# EAGLE design joystickschematic (EAGLE 9.6.2)
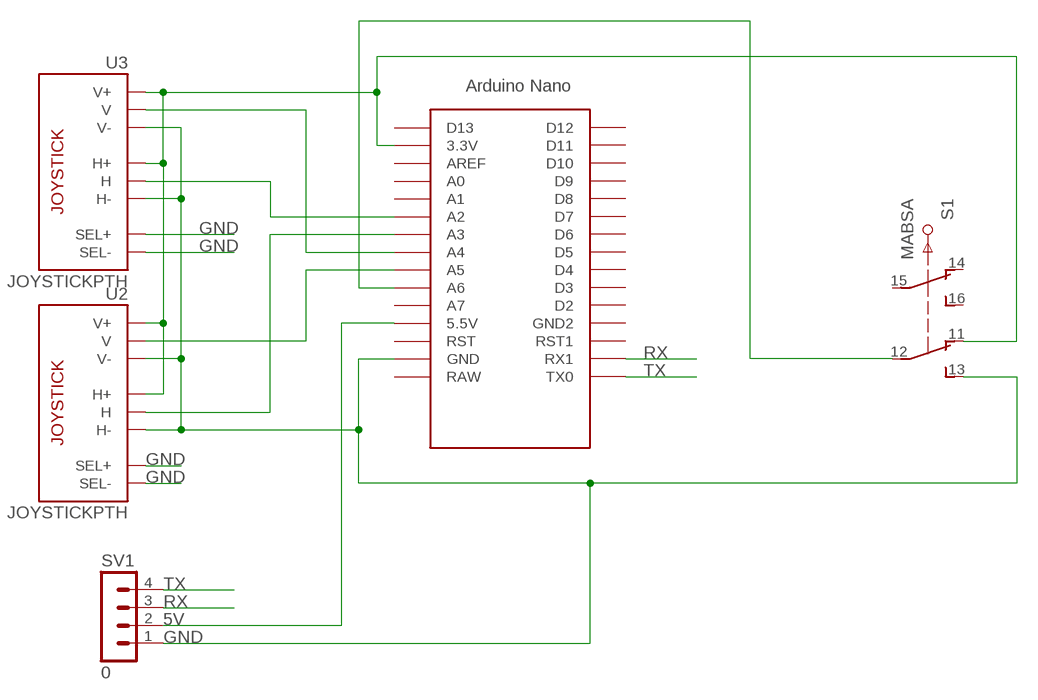
[diagram p0: schematic, sheet 1]

## Parts
S1  MABSA  [MABSA]
SV1  0  MA04-1  [MA04-1]
U2  JOYSTICKPTH  [JOYSTICK]
U3  JOYSTICKPTH  [JOYSTICK]
U$2  NANO  [NANO]

## Nets
3.3V: S1.11 U2.H1(H+) U2.V1(V+) U3.H1(H+) U3.V1(V+) U$2.3.3V
5V: SV1.2 U$2.5V(5.5V)
GND: S1.13 SV1.1 U2.B1A(SEL+) U2.B2A(SEL-) U2.H3(H-) U2.V3(V-) U3.B1A(SEL+) U3.B2A(SEL-) U3.H3(H-) U3.V3(V-) U$2.GND
N$1: U3.V2(V) U$2.A4
N$2: U3.H2(H) U$2.A2
N$4: U2.H2(H) U$2.A3
N$5: U2.V2(V) U$2.A5
N$7: S1.12 U$2.A6
RX: SV1.3 U$2.RX1
TX: SV1.4 U$2.TX0
Unconnected: S1.14 S1.15 S1.16 U$2.A0 U$2.A1 U$2.A7 U$2.AREF U$2.D2 U$2.D3 U$2.D4 U$2.D5 U$2.D6 U$2.D7 U$2.D8 U$2.D9 U$2.D10 U$2.D11 U$2.D12 U$2.D13 U$2.GND1(GND2) U$2.RAW U$2.RST U$2.RST1

## Library data of the parts
S1 = con-hirschmann:MABSA: Dual SWITCH; OC_FARNELL: unknown; OC_NEWARK: unknown
SV1 = con-lstb:MA04-1: PIN HEADER; OC_FARNELL: unknown; OC_NEWARK: unknown
U2 U3 = SparkFun:JOYSTICK: Thumb Joystick Joystick commonly found in PS2 controllers. Two pots and a select switch. Footprint proven. Spark Fun Electronics SKU : COM-09032
U$2 = Arduino-clone:NANO: Arduino Nano

## Board
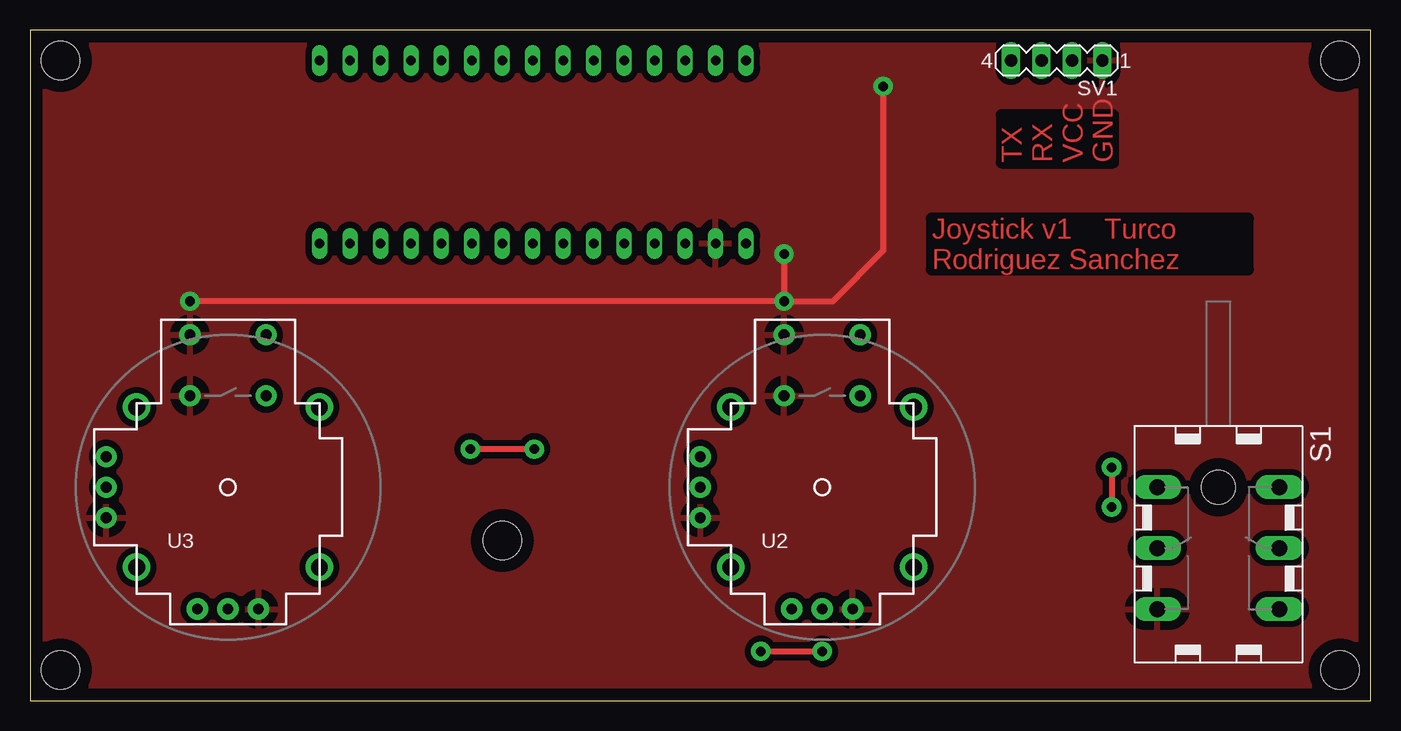
[diagram p1: board, top side]
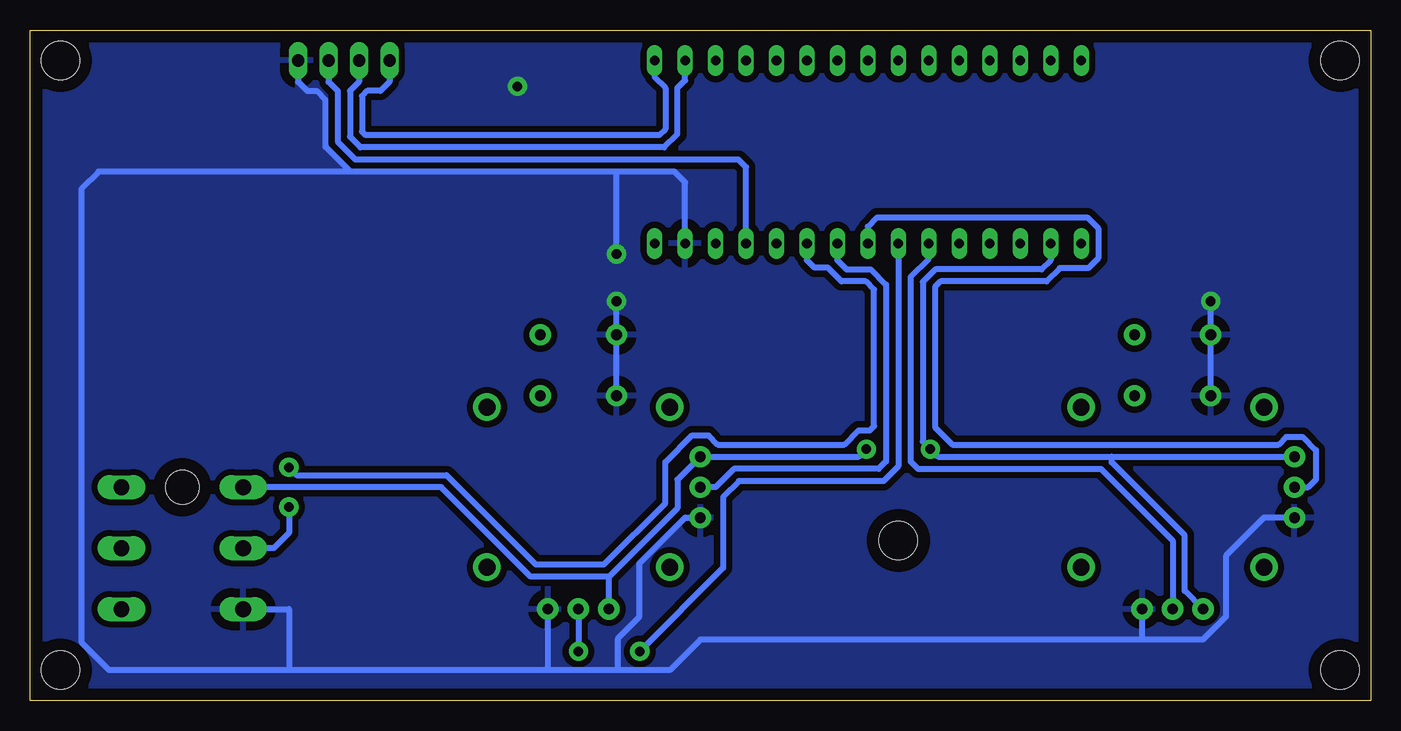
[diagram p2: board, bottom side, seen from below]

Size 111.76 x 55.88 mm. Coordinates in mm from the lower left corner, seen from the top.
Outline: 0,0 111.76,0 111.76,55.88 0,55.88 0,0
Copper layers (1*16): Top 0.035mm / dielectric 1.5mm / Bottom 0.035mm
Design rules "default *": minimum track width 20mil, minimum drill 0.35mm, track to track 20mil, track to pad 20mil, pad to pad 20mil, via to via 20mil, smd to smd 20mil, copper to edge 40mil, drill to drill 6mil, minimum pad ring 10mil, minimum via ring 8mil, stop-mask expansion 4mil, vias tented up to drill 0mil, thermal gap 30mil
Holes 3.2 mm at 2.54,53.34 39.37,13.34 2.54,2.54 109.22,2.54 109.22,53.34

### Footprints (pad centres in the part's own frame; a part is rotated, then mirrored left to right if it is on the bottom)
MABSA = drill 1.321 long: 11 5.08,-5.08; 12 5.08,0; 13 5.08,5.08; 14 -5.08,-5.08; 15 -5.08,0; 16 -5.08,5.08 | hole 2.794: 0,-5.08
MA04-1 = drill 1.016 long: 1 -3.81,0; 2 -1.27,0; 3 1.27,0; 4 3.81,0
JOYSTICK = drill 0.9 pad 1.778: B1A -3.175,12.7; B1B 3.175,12.7; B2A -3.175,7.62; B2B 3.175,7.62 | drill 0.889 pad 1.778: H1 -2.54,-10.16; H2 0,-10.16; H3 2.54,-10.16; V1 -10.16,2.54; V2 -10.16,0; V3 -10.16,-2.54 | drill 1.397 pad 2.286: MOUNT1 -7.62,6.668; MOUNT2 -7.62,-6.668; MOUNT3 7.62,-6.668; MOUNT4 7.62,6.668
NANO = drill 0.8 long: 3.3V -10.16,24.13; 5V -10.16,-1.27; A0 -10.16,19.05; A1 -10.16,16.51; A2 -10.16,13.97; A3 -10.16,11.43; A4 -10.16,8.89; A5 -10.16,6.35; A6 -10.16,3.81; A7 -10.16,1.27; AREF -10.16,21.59; D2 5.08,1.27; D3 5.08,3.81; D4 5.08,6.35; D5 5.08,8.89; D6 5.08,11.43; D7 5.08,13.97; D8 5.08,16.51; D9 5.08,19.05; D10 5.08,21.59; D11 5.08,24.13; D12 5.08,26.67; D13 -10.16,26.67; GND -10.16,-6.35; GND1 5.08,-1.27; RAW -10.16,-8.89; RST -10.16,-3.81; RST1 5.08,-3.81; RX1 5.08,-6.35; TX0 5.08,-8.89

### Placement (x,y rotation side)
S1  99.06,12.7 180 top
SV1  85.6,53.34 180 top
U2  66.04,17.78 0 top
U3  16.51,17.78 0 top
U$2  50.8,48.26 90 top

### Tracks (layer width: path | path; a pad name or v marks a point on that pad's centre or on a via)
3.3V  (via drill 0.8 pad 1.6)
  Top 0.508: v42.04,20.95 v36.7,20.95
  Bottom 0.508: 21.59,20.32 U3.V1 | 21.59,20.32 36.07,20.32 v36.7,20.95 37.34,21.59 37.34,34.88 36.28,35.94 27.43,35.94 26.67,36.7 U$2.3.3V | S1.11 77.47,17.78 70.02,10.33 63.5,10.33 | U3.H1 15.49,9.14 15.49,13.76 21.59,19.85 21.59,20.32 | U2.H1 63.5,10.33 | 63.5,10.33 57.78,16.04 57.78,18.41 U2.V1 42.67,20.32 v42.04,20.95
5V
  Bottom 0.508: U$2.5V 52.07,44.45 52.7,45.09 84.62,45.09 86.11,46.57 86.11,50.8 86.87,51.56 SV1.2
GND  (via drill 0.8 pad 1.6)
  Top 0.508: v62.87,37.21 v62.87,33.27 | v62.87,33.27 v13.34,33.27 | v62.87,33.27 66.93,33.27 71.12,37.47 v71.12,51.18
  Bottom 0.508: 19.05,5.08 U3.H3 | U$2.GND 57.15,43.18 58.04,44.07 62.87,44.07 | U3.V3 8.89,15.24 12.06,12.06 12.06,6.99 13.97,5.08 19.05,5.08 | 19.05,5.08 55.88,5.08 58.42,2.54 62.74,2.54 | 68.58,2.54 90.17,2.54 | S1.13 90.17,7.62 90.17,2.54 | 62.74,2.54 62.74,5.21 60.96,6.99 60.96,11.43 57.15,15.24 U2.V3 | 62.74,2.54 68.58,2.54 | 68.58,2.54 U2.H3 | U3.B2A U3.B1A v13.34,33.27 | U2.B2A U2.B1A v62.87,33.27 | v62.87,37.21 62.87,44.07 | 85.04,44.07 87.12,46.15 87.12,50.04 87.88,50.8 88.65,50.8 89.41,51.56 SV1.1 | 62.87,44.07 85.04,44.07 | 90.17,2.54 105.16,2.54 107.44,4.83 107.44,42.67 106.05,44.07 85.04,44.07
  pour Top: 0,55.88 111.76,55.88 111.76,0 0,0
  pour Bottom: 0,55.88 111.76,55.88 111.76,0 0,0
N$1
  Bottom 0.508: U3.V2 5.21,17.78 4.57,18.41 4.57,20.88 5.67,21.97 7.03,21.97 7.67,21.34 34.88,21.34 36.32,22.78 36.32,34.46 35.86,34.92 27.01,34.92 25.91,36.03 23.54,36.03 22.71,36.86 22.71,39.34 23.63,40.26 41.15,40.26 41.91,39.5 U$2.A4
N$2
  Bottom 0.508: U$2.A2 36.83,36.83 38.35,35.31 38.35,19.94 37.72,19.3 22.48,19.3 16.51,13.34 U3.H2
N$4  (via drill 0.8 pad 1.6)
  Top 0.508: v60.92,4.1 v66.04,4.1
  Bottom 0.508: U2.H2 v66.04,4.1 | U$2.A3 39.37,19.52 40.6,18.29 52.66,18.29 53.98,16.98 53.98,11.05 v60.92,4.1
N$5
  Bottom 0.508: U$2.A5 44.45,36.7 43.69,35.94 41.66,35.94 40.39,34.67 40.39,19.94 41.02,19.3 53.09,19.3 54.61,17.78 U2.V2
N$7  (via drill 0.8 pad 1.6)
  Top 0.508: v90.17,19.43 v90.17,16.13
  Bottom 0.508: v90.17,16.13 90.17,13.97 91.44,12.7 S1.12 | v90.17,19.43 89.53,18.8 77.05,18.8 69.6,11.34 63.92,11.34 58.8,16.46 58.8,19.86 56.56,22.1 55.2,22.1 54.43,21.34 43.87,21.34 42.68,22.52 41.74,22.52 41.4,22.86 41.4,34.25 42.08,34.92 44.11,34.92 45.25,36.07 46.35,36.07 46.99,36.7 U$2.A6
RX
  Bottom 0.508: SV1.3 84.33,51.56 85.09,50.8 85.09,46.99 84.2,46.1 58.89,46.1 57.78,47.2 57.78,51.05 57.15,51.69 U$2.RX1
TX
  Bottom 0.508: U$2.TX0 59.69,51.94 58.8,51.05 58.8,47.62 59.31,47.12 83.78,47.12 84.07,47.41 84.07,50.38 83.65,50.8 82.55,50.8 81.79,51.56 SV1.4

### Text on the board
Top: TX / RX / VCC / GND | Joystick v1 Turco / Rodriguez Sanchez